# EAGLE design vl4e3 (EAGLE 6.0)

## Sheet 1 of 7
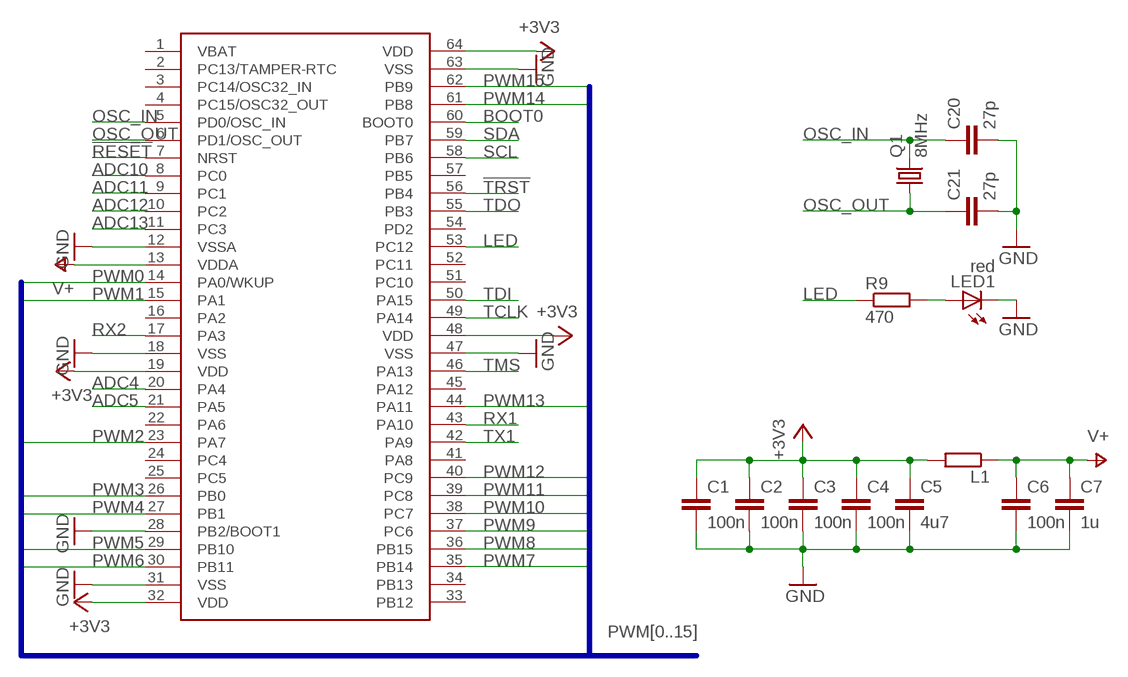
[diagram p0: schematic, sheet 1]

### Parts
C1  100n  C-EUC0603  [C0603]
C2  100n  C-EUC0603  [C0603]
C3  100n  C-EUC0603  [C0603]
C4  100n  C-EUC0603  [C0603]
C5  4u7  C-EUC0805  [C0805]
C6  100n  C-EUC0603  [C0603]
C7  1u  C-EUC0805  [C0805]
C20  27p  C-EUC0603  [C0603]
C21  27p  C-EUC0603  [C0603]
L1  R-EU_R0805  [R0805]
LED1  red  LEDCHIPLED_0805  [CHIPLED_0805]
Q1  8MHz  CRYSTALHC49S  [HC49/S]
R9  470  R-EU_R0805  [R0805]
U$1  STM32F100R  [TQFP64-10X10]

### Nets
!RESET: U$1.7(NRST) ; also sheet 3
!TRST: U$1.56(PB4) ; also sheet 3
+3V3: C1.1 C2.1 C3.1 C4.1 C5.1 L1.2 U$1.19(VDD) U$1.32(VDD) U$1.48(VDD) U$1.64(VDD) ; also sheet 2,4,5
ADC4: U$1.20(PA4) ; also sheet 5
ADC5: U$1.21(PA5) ; also sheet 5
ADC10: U$1.8(PC0) ; also sheet 5
ADC11: U$1.9(PC1) ; also sheet 5
ADC12: U$1.10(PC2) ; also sheet 5
ADC13: U$1.11(PC3) ; also sheet 5
BOOT0: U$1.60(BOOT0) ; also sheet 3
GND: C1.2 C2.2 C3.2 C4.2 C5.2 C6.2 C7.2 C20.2 C21.2 LED1.C U$1.12(VSSA) U$1.18(VSS) U$1.28(PB2/BOOT1) U$1.31(VSS) U$1.47(VSS) U$1.63(VSS) ; also sheet 2,3,4,5,6,7
LED: R9.1 U$1.53(PC12)
LED_R: LED1.A R9.2
OSC_IN: C20.1 Q1.2 U$1.5(PD0/OSC_IN)
OSC_OUT: C21.1 Q1.1 U$1.6(PD1/OSC_OUT)
PWM0: U$1.14(PA0/WKUP) ; also sheet 6
PWM1: U$1.15(PA1) ; also sheet 6
PWM2: U$1.23(PA7) ; also sheet 6
PWM3: U$1.26(PB0) ; also sheet 6
PWM4: U$1.27(PB1) ; also sheet 6
PWM5: U$1.29(PB10) ; also sheet 6
PWM6: U$1.30(PB11) ; also sheet 6
PWM7: U$1.35(PB14) ; also sheet 6
PWM8: U$1.36(PB15) ; also sheet 6
PWM9: U$1.37(PC6) ; also sheet 6
PWM10: U$1.38(PC7) ; also sheet 6
PWM11: U$1.39(PC8) ; also sheet 6
PWM12: U$1.40(PC9) ; also sheet 6
PWM13: U$1.44(PA11) ; also sheet 6
PWM14: U$1.61(PB8) ; also sheet 6
PWM15: U$1.62(PB9) ; also sheet 6
RX1: U$1.43(PA10) ; also sheet 3
RX2: U$1.17(PA3) ; also sheet 4
SCL: U$1.58(PB6)
SDA: U$1.59(PB7)
TCLK: U$1.49(PA14) ; also sheet 3
TDI: U$1.50(PA15) ; also sheet 3
TDO: U$1.55(PB3) ; also sheet 3
TMS: U$1.46(PA13) ; also sheet 3
TX1: U$1.42(PA9) ; also sheet 3
V+: C6.1 C7.1 L1.1 U$1.13(VDDA)
Unconnected: U$1.1(VBAT) U$1.2(PC13/TAMPER-RTC) U$1.3(PC14/OSC32_IN) U$1.4(PC15/OSC32_OUT) U$1.16(PA2) U$1.22(PA6) U$1.24(PC4) U$1.25(PC5) U$1.33(PB12) U$1.34(PB13) U$1.41(PA8) U$1.45(PA12) U$1.51(PC10) U$1.52(PC11) U$1.54(PD2) U$1.57(PB5)

### Buses
PWM[0..15]

## Sheet 2 of 7
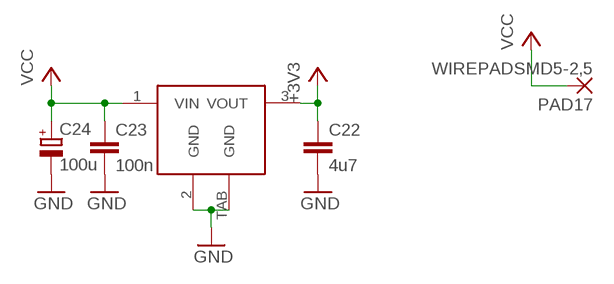
[diagram p1: schematic, sheet 2]

### Parts
C22  4u7  C-EUC0805  [C0805]
C23  100n  C-EUC0603  [C0603]
C24  100u  CPOL-EUE2.5-6  [E2,5-6]
PAD17  WIREPADSMD5-2,5  [5-2,5]
U$10  MIC5209  [SOT223]

### Nets
+3V3: C22.1 U$10.3(VOUT) ; also sheet 1,4,5
GND: C22.2 C23.2 C24.- U$10.2(GND) U$10.TAB(GND) ; also sheet 1,3,4,5,6,7
VCC: C23.1 C24.+ PAD17.1(P) U$10.1(VIN) ; also sheet 6

## Sheet 3 of 7
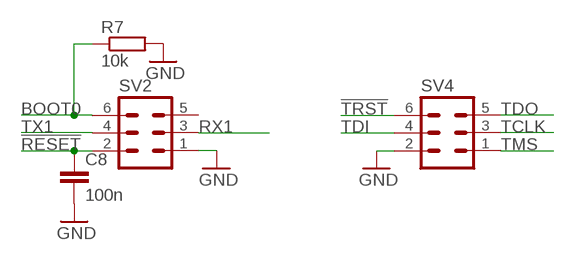
[diagram p2: schematic, sheet 3]

### Parts
C8  100n  C-EUC0603  [C0603]
R7  10k  R-EU_R0603  [R0603]
SV2  MA03-2  [MA03-2]
SV4  MA03-2  [MA03-2]

### Nets
!RESET: C8.1 SV2.2 ; also sheet 1
!TRST: SV4.6 ; also sheet 1
BOOT0: R7.1 SV2.6 ; also sheet 1
GND: C8.2 R7.2 SV2.1 SV4.2 ; also sheet 1,2,4,5,6,7
RX1: SV2.3 ; also sheet 1
TCLK: SV4.3 ; also sheet 1
TDI: SV4.4 ; also sheet 1
TDO: SV4.5 ; also sheet 1
TMS: SV4.1 ; also sheet 1
TX1: SV2.4 ; also sheet 1
Unconnected: SV2.5

## Sheet 4 of 7
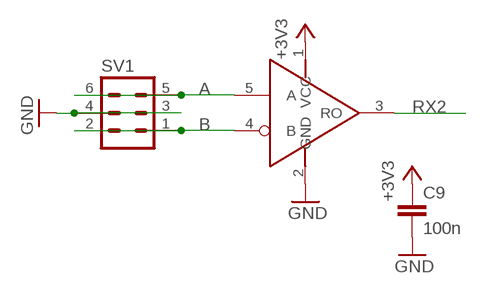
[diagram p3: schematic, sheet 4]

### Parts
C9  100n  C-EUC0603  [C0603]
SV1  MA03-2  [MA03-2]
U$13  ISL3280E  [SOT23-5L]

### Nets
+3V3: C9.1 U$13.1(VCC) ; also sheet 1,2,5
A: SV1.5 SV1.6 U$13.5(A)
B: SV1.1 SV1.2 U$13.4(B)
GND: C9.2 SV1.3 SV1.4 U$13.2(GND) ; also sheet 1,2,3,5,6,7
RX2: U$13.3(RO) ; also sheet 1

## Sheet 5 of 7
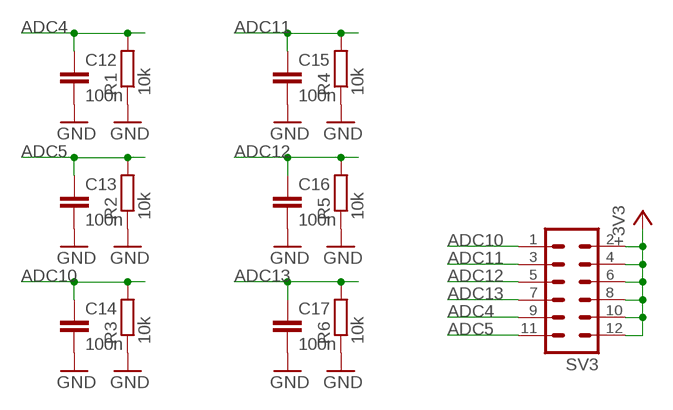
[diagram p4: schematic, sheet 5]

### Parts
C12  100n  C-EUC0603  [C0603]
C13  100n  C-EUC0603  [C0603]
C14  100n  C-EUC0603  [C0603]
C15  100n  C-EUC0603  [C0603]
C16  100n  C-EUC0603  [C0603]
C17  100n  C-EUC0603  [C0603]
R1  10k  R-EU_R0603  [R0603]
R2  10k  R-EU_R0603  [R0603]
R3  10k  R-EU_R0603  [R0603]
R4  10k  R-EU_R0603  [R0603]
R5  10k  R-EU_R0603  [R0603]
R6  10k  R-EU_R0603  [R0603]
SV3  MA06-2  [MA06-2]

### Nets
+3V3: SV3.2 SV3.4 SV3.6 SV3.8 SV3.10 SV3.12 ; also sheet 1,2,4
ADC4: C12.1 R1.2 SV3.9 ; also sheet 1
ADC5: C13.1 R2.2 SV3.11 ; also sheet 1
ADC10: C14.1 R3.2 SV3.1 ; also sheet 1
ADC11: C15.1 R4.2 SV3.3 ; also sheet 1
ADC12: C16.1 R5.2 SV3.5 ; also sheet 1
ADC13: C17.1 R6.2 SV3.7 ; also sheet 1
GND: C12.2 C13.2 C14.2 C15.2 C16.2 C17.2 R1.1 R2.1 R3.1 R4.1 R5.1 R6.1 ; also sheet 1,2,3,4,6,7

## Sheet 6 of 7
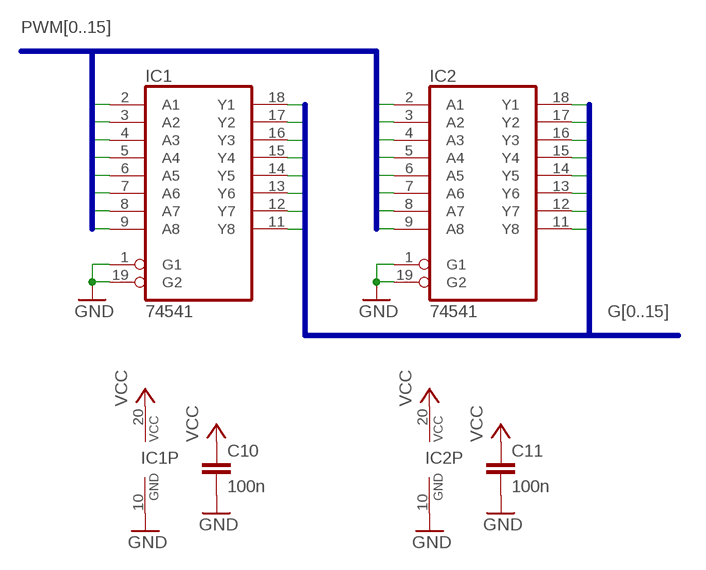
[diagram p5: schematic, sheet 6]

### Parts
C10  100n  C-EUC0603  [C0603]
C11  100n  C-EUC0603  [C0603]
IC1  74541  [TSSOP20]
IC2  74541  [TSSOP20]

### Nets
G0: IC1.18(Y1) ; also sheet 7
G1: IC1.17(Y2) ; also sheet 7
G2: IC1.16(Y3) ; also sheet 7
G3: IC1.15(Y4) ; also sheet 7
G4: IC1.14(Y5) ; also sheet 7
G5: IC1.13(Y6) ; also sheet 7
G6: IC1.12(Y7) ; also sheet 7
G7: IC1.11(Y8) ; also sheet 7
G8: IC2.18(Y1) ; also sheet 7
G9: IC2.17(Y2) ; also sheet 7
G10: IC2.16(Y3) ; also sheet 7
G11: IC2.15(Y4) ; also sheet 7
G12: IC2.14(Y5) ; also sheet 7
G13: IC2.13(Y6) ; also sheet 7
G14: IC2.12(Y7) ; also sheet 7
G15: IC2.11(Y8) ; also sheet 7
GND: C10.2 C11.2 IC1.1(G1) IC1.10(GND) IC1.19(G2) IC2.1(G1) IC2.10(GND) IC2.19(G2) ; also sheet 1,2,3,4,5,7
PWM0: IC1.2(A1) ; also sheet 1
PWM1: IC1.3(A2) ; also sheet 1
PWM2: IC1.4(A3) ; also sheet 1
PWM3: IC1.5(A4) ; also sheet 1
PWM4: IC1.6(A5) ; also sheet 1
PWM5: IC1.7(A6) ; also sheet 1
PWM6: IC1.8(A7) ; also sheet 1
PWM7: IC1.9(A8) ; also sheet 1
PWM8: IC2.2(A1) ; also sheet 1
PWM9: IC2.3(A2) ; also sheet 1
PWM10: IC2.4(A3) ; also sheet 1
PWM11: IC2.5(A4) ; also sheet 1
PWM12: IC2.6(A5) ; also sheet 1
PWM13: IC2.7(A6) ; also sheet 1
PWM14: IC2.8(A7) ; also sheet 1
PWM15: IC2.9(A8) ; also sheet 1
VCC: C10.1 C11.1 IC1.20(VCC) IC2.20(VCC) ; also sheet 2

### Buses
PWM[0..15]
G[0..15]

## Sheet 7 of 7
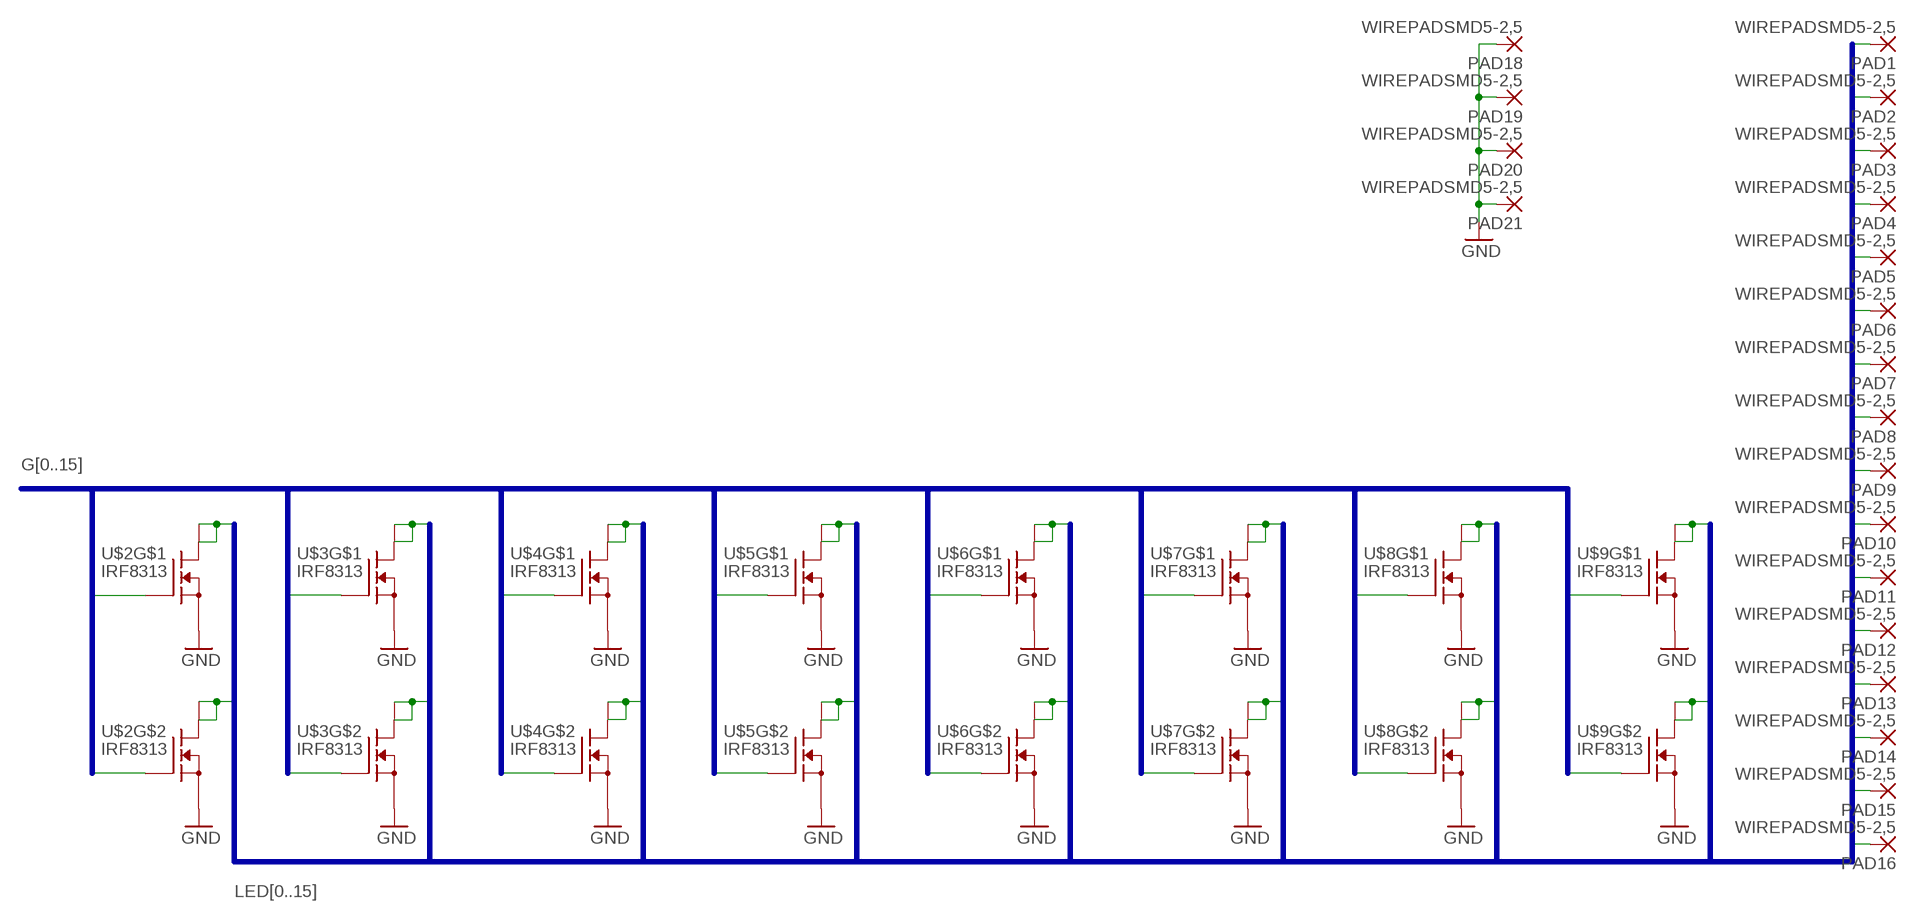
[diagram p6: schematic, sheet 7]

### Parts
PAD1  WIREPADSMD5-2,5  [5-2,5]
PAD2  WIREPADSMD5-2,5  [5-2,5]
PAD3  WIREPADSMD5-2,5  [5-2,5]
PAD4  WIREPADSMD5-2,5  [5-2,5]
PAD5  WIREPADSMD5-2,5  [5-2,5]
PAD6  WIREPADSMD5-2,5  [5-2,5]
PAD7  WIREPADSMD5-2,5  [5-2,5]
PAD8  WIREPADSMD5-2,5  [5-2,5]
PAD9  WIREPADSMD5-2,5  [5-2,5]
PAD10  WIREPADSMD5-2,5  [5-2,5]
PAD11  WIREPADSMD5-2,5  [5-2,5]
PAD12  WIREPADSMD5-2,5  [5-2,5]
PAD13  WIREPADSMD5-2,5  [5-2,5]
PAD14  WIREPADSMD5-2,5  [5-2,5]
PAD15  WIREPADSMD5-2,5  [5-2,5]
PAD16  WIREPADSMD5-2,5  [5-2,5]
PAD18  WIREPADSMD5-2,5  [5-2,5]
PAD19  WIREPADSMD5-2,5  [5-2,5]
PAD20  WIREPADSMD5-2,5  [5-2,5]
PAD21  WIREPADSMD5-2,5  [5-2,5]
U$2  IRF8313  [SO-08]
U$3  IRF8313  [SO-08]
U$4  IRF8313  [SO-08]
U$5  IRF8313  [SO-08]
U$6  IRF8313  [SO-08]
U$7  IRF8313  [SO-08]
U$8  IRF8313  [SO-08]
U$9  IRF8313  [SO-08]

### Nets
G0: U$2.2(G) ; also sheet 6
G1: U$2.4(G) ; also sheet 6
G2: U$3.2(G) ; also sheet 6
G3: U$3.4(G) ; also sheet 6
G4: U$4.2(G) ; also sheet 6
G5: U$4.4(G) ; also sheet 6
G6: U$5.2(G) ; also sheet 6
G7: U$5.4(G) ; also sheet 6
G8: U$6.2(G) ; also sheet 6
G9: U$6.4(G) ; also sheet 6
G10: U$7.2(G) ; also sheet 6
G11: U$7.4(G) ; also sheet 6
G12: U$8.2(G) ; also sheet 6
G13: U$8.4(G) ; also sheet 6
G14: U$9.2(G) ; also sheet 6
G15: U$9.4(G) ; also sheet 6
GND: PAD18.1(P) PAD19.1(P) PAD20.1(P) PAD21.1(P) U$2.1(S) U$2.3(S) U$3.1(S) U$3.3(S) U$4.1(S) U$4.3(S) U$5.1(S) U$5.3(S) U$6.1(S) U$6.3(S) U$7.1(S) U$7.3(S) U$8.1(S) U$8.3(S) U$9.1(S) U$9.3(S) ; also sheet 1,2,3,4,5,6
LED0: PAD1.1(P) U$2.7(D) U$2.8(D)
LED1: PAD2.1(P) U$2.5(D) U$2.6(D)
LED2: PAD3.1(P) U$3.7(D) U$3.8(D)
LED3: PAD4.1(P) U$3.5(D) U$3.6(D)
LED4: PAD5.1(P) U$4.7(D) U$4.8(D)
LED5: PAD6.1(P) U$4.5(D) U$4.6(D)
LED6: PAD7.1(P) U$5.7(D) U$5.8(D)
LED7: PAD8.1(P) U$5.5(D) U$5.6(D)
LED8: PAD9.1(P) U$6.7(D) U$6.8(D)
LED9: PAD10.1(P) U$6.5(D) U$6.6(D)
LED10: PAD11.1(P) U$7.7(D) U$7.8(D)
LED11: PAD12.1(P) U$7.5(D) U$7.6(D)
LED12: PAD13.1(P) U$8.7(D) U$8.8(D)
LED13: PAD14.1(P) U$8.5(D) U$8.6(D)
LED14: PAD15.1(P) U$9.7(D) U$9.8(D)
LED15: PAD16.1(P) U$9.5(D) U$9.6(D)

### Buses
G[0..15]
LED[0..15]

## Library data of the parts
C1-C17 C20-C23 = rcl:C-EU: CAPACITOR, European symbol
C24 = rcl:CPOL-EU: POLARIZED CAPACITOR, European symbol
IC1 IC2 = 74xx-eu_new:74*541: Octal BUFFER and LINE DRIVER, 3-state
L1 R1-R7 R9 = rcl:R-EU_: RESISTOR, European symbol
LED1 = led:LED: LED OSRAM: - CHIPLED LG R971, LG N971, LY N971, LG Q971, LY Q971, LO R971, LY R971 LH N974, LH R974 LS Q976, LO Q976, LY Q976 LO Q996 - Hyper CHIPLED LW Q18S LB Q993, LB Q99A, LB R99A - SideLED LS A670, LO A670, LY A670, LG A670, LP A670 LB A673, LV A673, LT A673, LW A673 LH A674 LY A675 LS A676, LA A676, LO A676, LY A676, LW A676 LS A679, LY A679, LG A679 - Hyper Micro SIDELED® LS Y876, LA Y876, LO Y876, LY Y876 LT Y87S - SmartLED LW L88C, LW L88S LB L89C, LB L89S, LG L890 LS L89K, LO L89K, LY L89K LS L896, LA L896, LO L896, LY L896 - TOPLED LS T670, LO T670, LY T670, LG T670, LP T670 LSG T670, LSP T670, LSY T670, LOP T670, LYG T670 LG T671, LOG T671, LSG T671 LB T673, LV T673, LT T673, LW T673 LH T674 LS T676, LA T676, LO T676, LY T676, LB T676, LH T676, LSB T676, LW T676 LB T67C, LV T67C, LT T67C, LS T67K, LO T67K, LY T67K, LW E67C LS E67B, LA E67B, LO E67B, LY E67B, LB E67C, LV E67C, LT E67C LW T67C LS T679, LY T679, LG T679 LS T770, LO T770, LY T770, LG T770, LP T770 LB T773, LV T773, LT T773, LW T773 LH T774 LS E675, LA E675, LY E675, LS T675 LS T776, LA T776, LO T776, LY T776, LB T776 LHGB T686 LT T68C, LB T68C - Hyper Mini TOPLED® LB M676 - Mini TOPLED Santana® LG M470 LS M47K, LO M47K, LY M47K Source: http://www.osram.convergy.de LUXEON: - LUMILED® LXK2-PW12-R00, LXK2-PW12-S00, LXK2-PW14-U00, LXK2-PW14-V00 LXK2-PM12-R00, LXK2-PM12-S00, LXK2-PM14-U00 LXK2-PE12-Q00, LXK2-PE12-R00, LXK2-PE12-S00, LXK2-PE14-T00, LXK2-PE14-U00 LXK2-PB12-K00, LXK2-PB12-L00, LXK2-PB12-M00, LXK2-PB14-N00, LXK2-PB14-P00, LXK2-PB14-Q00 LXK2-PR12-L00, LXK2-PR12-M00, LXK2-PR14-Q00, LXK2-PR14-R00 LXK2-PD12-Q00, LXK2-PD12-R00, LXK2-PD12-S00 LXK2-PH12-R00, LXK2-PH12-S00 LXK2-PL12-P00, LXK2-PL12-Q00, LXK2-PL12-R00 Source: www.luxeon.com KINGBRIGHT: KA-3528ASYC Source: www.kingbright.com
PAD1-PAD21 = wirepad:WIREPAD: Wire PAD connect wire on PCB
Q1 = crystal:CRYSTAL: CRYSTAL; OC_FARNELL: 1667008; OC_NEWARK: unknown
SV1 SV2 SV4 = con-lstb:MA03-2: PIN HEADER; OC_FARNELL: unknown; OC_NEWARK: unknown
SV3 = con-lstb:MA06-2: PIN HEADER; OC_FARNELL: unknown; OC_NEWARK: unknown
U$1 = stm32f100r:STM32F100R
U$2-U$9 = irf8313:IRF8313
U$10 = mic5209:MIC5209
U$13 = isl3280e:ISL3280E

## Board
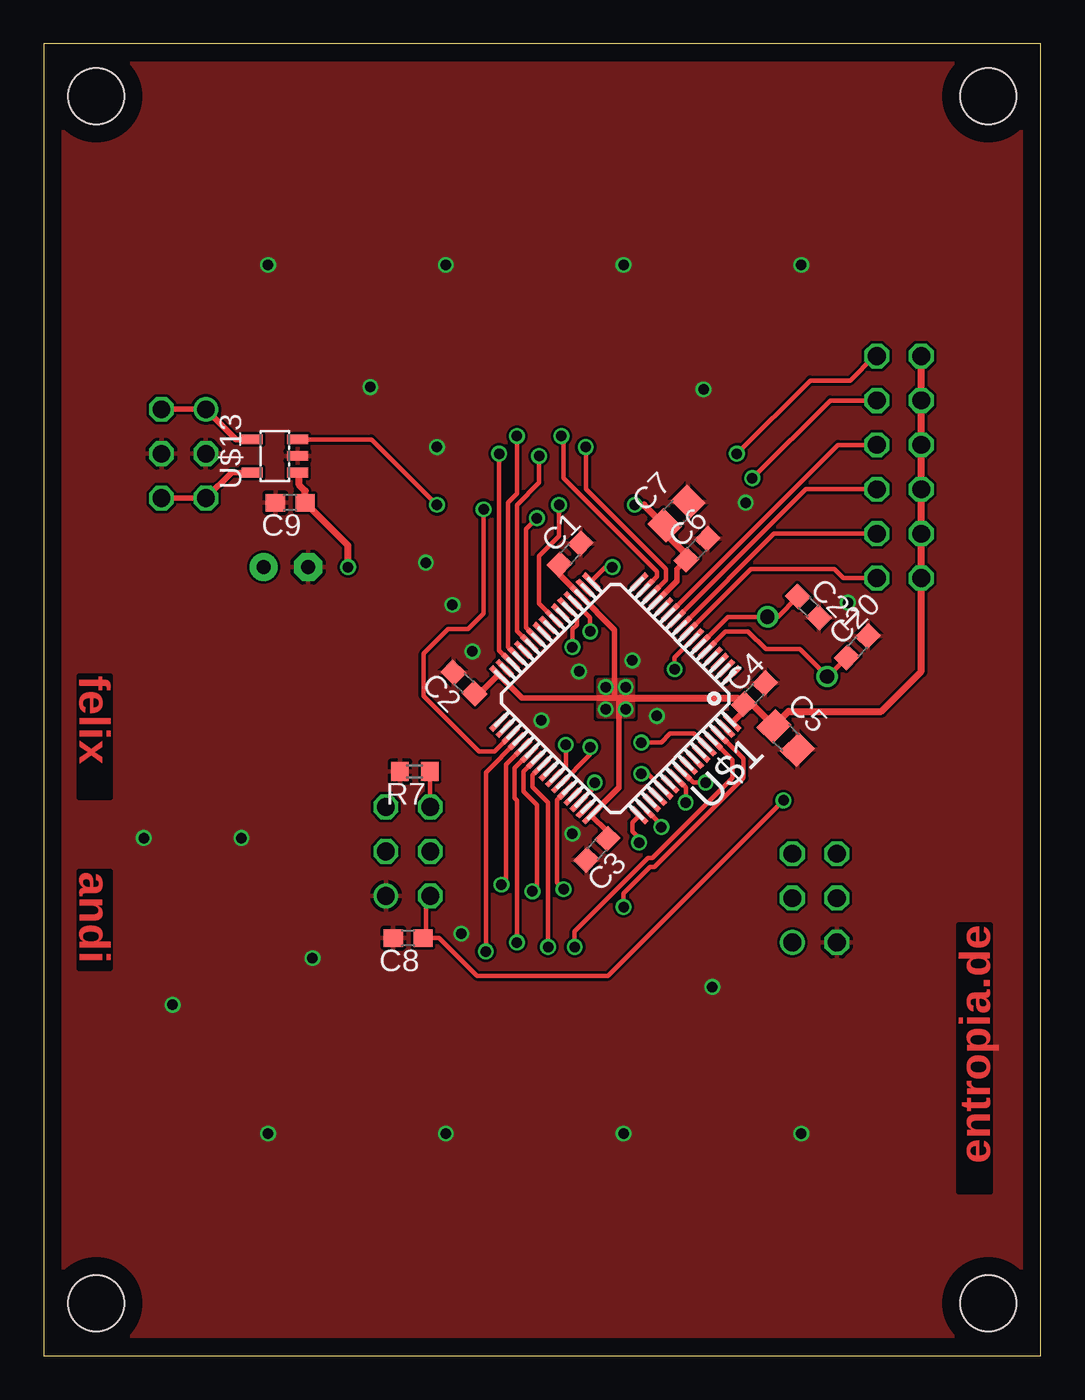
[diagram p7: board, top side]
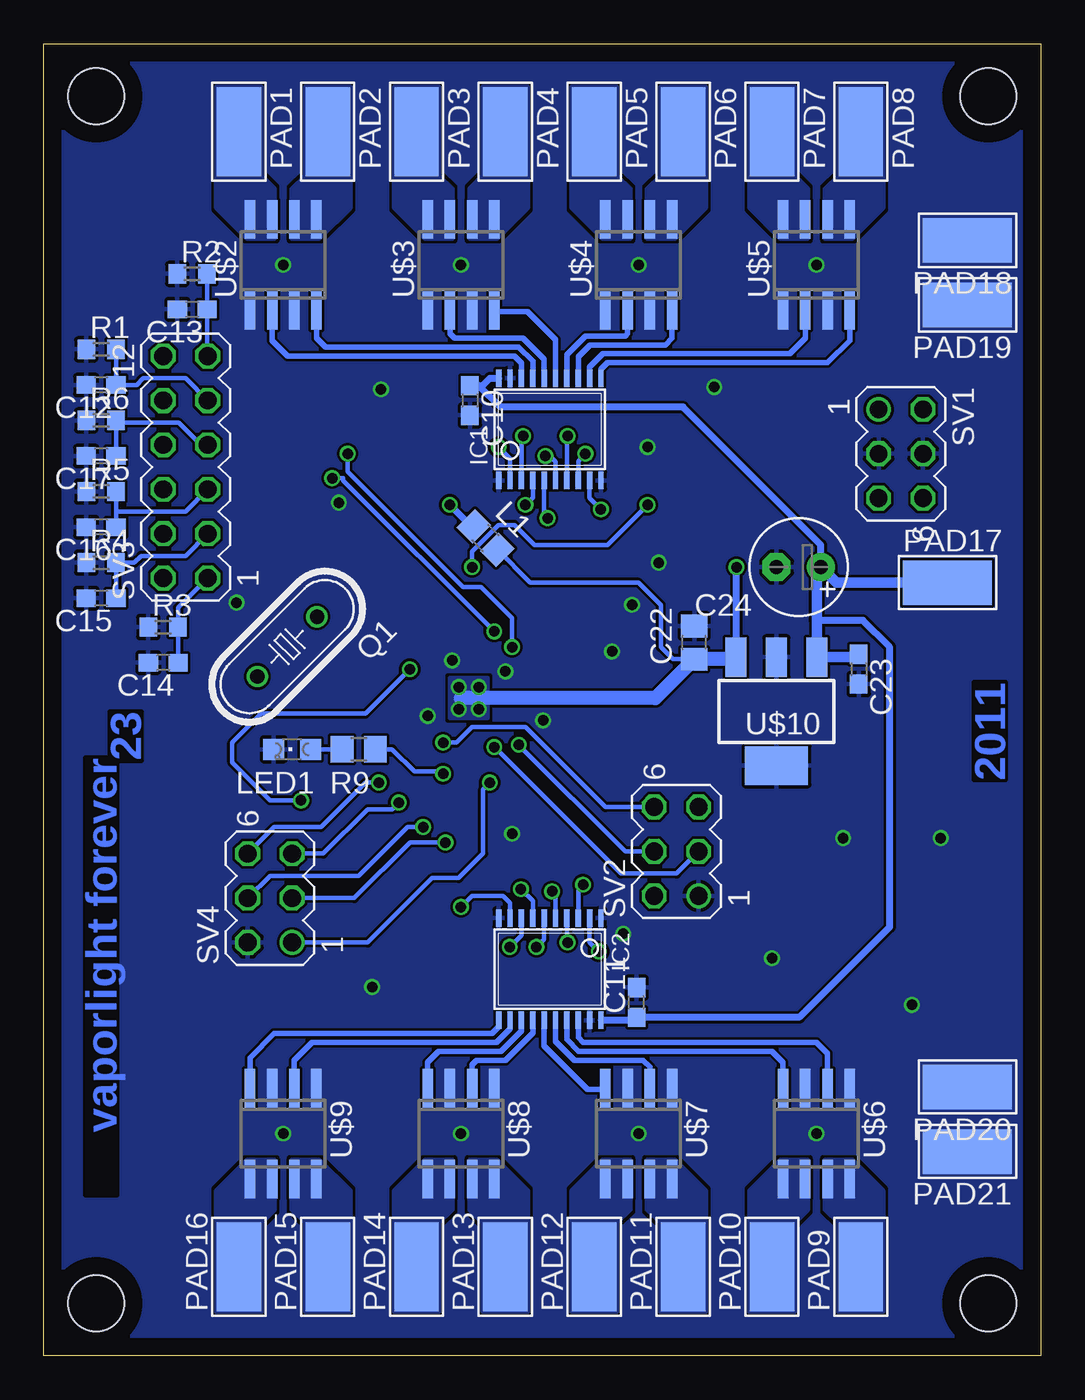
[diagram p8: board, bottom side, seen from below]

Size 57 x 75 mm. Coordinates in mm from the lower left corner, seen from the top.
Outline: 0,0 57,0 57,75 0,75 0,0
Copper layers (1*16): Top 0.035mm / dielectric 1.5mm / Bottom 0.035mm
Design rules: minimum track width 6mil, minimum drill 0.3mm, track to track 6mil, track to pad 6mil, pad to pad 6mil, via to via 6mil, smd to smd 6mil, copper to edge 40mil, drill to drill 8mil, minimum pad ring 8mil, minimum via ring 6mil, stop-mask expansion 3mil, vias tented up to drill 0mil, thermal gap 8mil
Holes 3.2 mm at 3,3 54,3 54,72 3,72

### Footprints (pad centres in the part's own frame; a part is rotated, then mirrored left to right if it is on the bottom)
C0603 = smd 1.1 x 1: 1 -0.85,0; 2 0.85,0
C0805 = smd 1.3 x 1.5: 1 -0.95,0; 2 0.95,0
E2,5-6 = drill 0.813 pad 1.6: + -1.27,0 | drill 0.813 pad 1.6 octagon: - 1.27,0
TSSOP20 = smd 0.305 x 0.991: 1 -2.925,-2.918; 2 -2.275,-2.918; 3 -1.625,-2.918; 4 -0.975,-2.918; 5 -0.325,-2.918; 6 0.325,-2.918; 7 0.975,-2.918; 8 1.625,-2.918; 9 2.275,-2.918; 10 2.925,-2.918; 11 2.925,2.918; 12 2.275,2.918; 13 1.625,2.918; 14 0.975,2.918; 15 0.325,2.918; 16 -0.325,2.918; 17 -0.975,2.918; 18 -1.625,2.918; 19 -2.275,2.918; 20 -2.925,2.918
R0805 = smd 1.3 x 1.5: 1 -0.95,0; 2 0.95,0
CHIPLED_0805 = smd 1.2 x 1.2: A 0,-1.05; C 0,1.05
5-2,5 = smd 2.54 x 5.08: 1 0,0
HC49/S = drill 0.813: 1 -2.413,0; 2 2.413,0
R0603 = smd 1 x 1.1: 1 -0.85,0; 2 0.85,0
MA03-2 = drill 1.016: 1 -2.54,-1.27 | drill 1.016 octagon: 2 -2.54,1.27; 3 0,-1.27; 4 0,1.27; 5 2.54,-1.27; 6 2.54,1.27
MA06-2 = drill 1.016 octagon: 1 -6.35,-1.27; 2 -6.35,1.27; 3 -3.81,-1.27; 4 -3.81,1.27; 5 -1.27,-1.27; 6 -1.27,1.27; 7 1.27,-1.27; 8 1.27,1.27; 9 3.81,-1.27; 10 3.81,1.27; 11 6.35,-1.27; 12 6.35,1.27
TQFP64-10X10 = smd 1.2 x 0.3: 1 -5.7,3.75; 2 -5.7,3.25; 3 -5.7,2.75; 4 -5.7,2.25; 5 -5.7,1.75; 6 -5.7,1.25; 7 -5.7,0.75; 8 -5.7,0.25; 9 -5.7,-0.25; 10 -5.7,-0.75; 11 -5.7,-1.25; 12 -5.7,-1.75; 13 -5.7,-2.25; 14 -5.7,-2.75; 15 -5.7,-3.25; 16 -5.7,-3.75; 33 5.7,-3.75; 34 5.7,-3.25; 35 5.7,-2.75; 36 5.7,-2.25; 37 5.7,-1.75; 38 5.7,-1.25; 39 5.7,-0.75; 40 5.7,-0.25; 41 5.7,0.25; 42 5.7,0.75; 43 5.7,1.25; 44 5.7,1.75; 45 5.7,2.25; 46 5.7,2.75; 47 5.7,3.25; 48 5.7,3.75 | smd 0.3 x 1.2: 17 -3.75,-5.7; 18 -3.25,-5.7; 19 -2.75,-5.7; 20 -2.25,-5.7; 21 -1.75,-5.7; 22 -1.25,-5.7; 23 -0.75,-5.7; 24 -0.25,-5.7; 25 0.25,-5.7; 26 0.75,-5.7; 27 1.25,-5.7; 28 1.75,-5.7; 29 2.25,-5.7; 30 2.75,-5.7; 31 3.25,-5.7; 32 3.75,-5.7; 49 3.75,5.7; 50 3.25,5.7; 51 2.75,5.7; 52 2.25,5.7; 53 1.75,5.7; 54 1.25,5.7; 55 0.75,5.7; 56 0.25,5.7; 57 -0.25,5.7; 58 -0.75,5.7; 59 -1.25,5.7; 60 -1.75,5.7; 61 -2.25,5.7; 62 -2.75,5.7; 63 -3.25,5.7; 64 -3.75,5.7
SO-08 = smd 0.6 x 2.2: 1 -1.905,-2.6; 2 -0.635,-2.6; 3 0.635,-2.6; 4 1.905,-2.6; 5 1.905,2.6; 6 0.635,2.6; 7 -0.635,2.6; 8 -1.905,2.6
SOT223 = smd 1.219 x 2.235: 1 -2.311,-3.099; 2 0,-3.099; 3 2.311,-3.099 | smd 3.6 x 2.2: TAB 0,3.099
SOT23-5L = smd 0.55 x 1.2: 1 -0.95,-1.3; 2 0,-1.3; 3 0.95,-1.3; 4 0.95,1.3; 5 -0.95,1.3

### Placement (x,y rotation side)
C1  30.09,45.84 45 top
C2  24.02,38.46 135 top
C3  31.62,28.96 225 top
C4  40.62,37.85 45 top
C5  42.42,35.32 315 top
C6  37.34,46.1 45 top
C7  36.17,48.14 45 top
C8  20.83,23.88 180 top
C9  14.1,48.77 180 top
C10  32.64,54.61 270 bottom
C11  23.11,20.19 90 bottom
C12  53.72,55.5 180 bottom
C13  48.51,59.82 180 bottom
C14  50.16,39.62 180 bottom
C15  53.72,43.31 180 bottom
C16  53.72,47.37 180 bottom
C17  53.72,51.44 180 bottom
C20  46.52,40.53 45 top
C21  43.72,42.8 315 top
C22  19.81,40.77 90 bottom
C23  10.41,39.24 270 bottom
C24  13.84,45.09 180 bottom
IC1  28.07,52.96 0 bottom
IC2  28.07,22.1 180 bottom
L1  31.74,46.75 315 bottom
LED1  42.8,34.67 90 bottom
PAD1  45.85,69.98 180 bottom
PAD2  40.77,69.98 180 bottom
PAD3  35.69,69.98 180 bottom
PAD4  30.61,69.98 180 bottom
PAD5  25.53,69.98 180 bottom
PAD6  20.45,69.98 180 bottom
PAD7  15.37,69.98 180 bottom
PAD8  10.29,69.98 180 bottom
PAD9  10.29,5.08 0 bottom
PAD10  15.37,5.08 0 bottom
PAD11  20.45,5.08 0 bottom
PAD12  25.53,5.08 0 bottom
PAD13  30.61,5.08 0 bottom
PAD14  35.69,5.08 0 bottom
PAD15  40.77,5.08 0 bottom
PAD16  45.85,5.08 0 bottom
PAD17  5.33,44.2 270 bottom
PAD18  4.19,63.75 90 bottom
PAD19  4.19,60.07 90 bottom
PAD20  4.19,15.37 90 bottom
PAD21  4.19,11.68 90 bottom
Q1  43.08,40.53 225 bottom
R1  53.72,57.53 0 bottom
R2  48.51,61.85 0 bottom
R3  50.16,41.66 0 bottom
R4  53.72,45.34 0 bottom
R5  53.72,49.4 0 bottom
R6  53.72,53.47 0 bottom
R7  21.21,33.4 180 top
R9  38.99,34.67 180 bottom
SV1  8,51.56 270 bottom
SV2  20.83,28.83 90 bottom
SV3  48.9,50.8 90 bottom
SV4  44.07,26.16 90 bottom
U$1  32.68,37.57 225 top
U$2  43.31,62.36 0 bottom
U$3  33.15,62.36 0 bottom
U$4  22.99,62.36 0 bottom
U$5  12.83,62.36 0 bottom
U$6  12.83,12.7 180 bottom
U$7  22.99,12.7 180 bottom
U$8  33.15,12.7 180 bottom
U$9  43.31,12.7 180 bottom
U$10  15.11,36.83 180 bottom
U$13  13.21,51.44 90 top

### Tracks (layer width: path | path; a pad name or v marks a point on that pad's centre or on a via)
!RESET  (via drill 0.6)
  Top 0.254: U$1.7 36.07,39.9 v36.07,39.24 | v42.29,31.75 32.26,21.72 24.77,21.72 22.61,23.88 C8.1 | C8.1 | SV2.2 21.84,26.04 21.84,24.04 C8.1
  Bottom 0.254: v36.07,39.24 38.61,36.7 44.58,36.7 46.23,35.05 46.23,33.91 44.07,31.75 v42.29,31.75
!TRST  (via drill 0.6)
  Top 0.254: U$1.56 37.13,32.77 v37.85,32.77
  Bottom 0.254: SV4.6 43.81,30.23 41.15,30.23 38.61,32.77 v37.85,32.77
+3V3  (via drill 0.6)
  Top 0.305: C2.1 24.9,37.86 U$1.32 27.35,37.59 32.64,37.59 | C3.1 32.22,29.96 U$1.48 32.89,32.49 32.89,37.59 32.64,37.59 | C1.1 29.49,44.65 U$1.19 32.64,41.5 32.64,37.59 | 40.02,36.86 U$1.64
  Top 0.406: U$13.1 14.61,50.39 14.61,49.78 14.95,49.44 C9.1 17.4,46.32 v17.4,45.09 | SV3.12 SV3.10 SV3.8 SV3.6 SV3.4 SV3.2 50.16,39.12 47.88,36.83 42.58,36.83 C5.1 40.5,37.24 C4.1 | 32.89,37.59 39.67,37.59 C4.1 | C4.1 40.02,36.86
  Bottom 0.254: L1.2 29.19,44.2 22.99,44.2 21.72,42.93 21.72,40.51 21.02,39.82 C22.1
  Bottom 0.406: v17.4,45.09 17.4,39.95 U$10.3
  Bottom 0.813: U$10.3 17.54,39.82 C22.1 22.04,37.59 33.15,37.59
  other vias: 32.13,38.23 33.27,38.23 33.27,36.96 32.13,36.96
  pour Top (rank 3, no thermals): 31.75,38.61 33.66,38.61 33.66,36.58 31.75,36.58
  pour Bottom (rank 3, no thermals): 33.78,38.73 31.62,38.73 31.62,36.45 33.78,36.45
A
  Top 0.305: U$13.5 10.73,50.48 SV1.5 SV1.6
ADC4  (via drill 0.6)
  Top 0.254: U$1.20 31.24,42.19 v31.24,41.4 | v40.51,50.16 44.96,54.61 SV3.9
  Bottom 0.254: R1.2 C12.1 51.69,55.5 51.31,55.88 48.9,55.88 SV3.9 | v40.51,50.16 39.88,50.16 39.88,50.04 v31.24,41.4
ADC5  (via drill 0.6)
  Top 0.254: U$1.21 30.48,42.24 30.48,41.78 30.23,41.53 v30.23,40.51 | v39.62,51.56 43.81,55.75 46.1,55.75 47.5,57.15 SV3.11
  Bottom 0.254: R2.2 C13.1 47.66,57.19 SV3.11 | v30.23,40.51 30.23,42.16 32,43.94 33.02,43.94 39.62,50.55 v39.62,51.56
ADC10
  Top 0.254: SV3.1 45.72,44.45 45.21,44.96 40.41,44.96 U$1.8
  Bottom 0.254: C14.1 R3.2 49.31,42.76 SV3.1
ADC11
  Top 0.254: U$1.9 41.74,46.99 SV3.3
  Bottom 0.254: SV3.3 48.9,45.72 51.44,45.72 51.82,45.34 R4.2 C15.1
ADC12
  Top 0.254: U$1.10 43.57,49.53 SV3.5
  Bottom 0.254: SV3.5 48.9,48.26 52.83,48.26 | 52.83,48.26 52.87,48.22 C16.1 | 52.83,48.26 52.87,48.3 R5.2
ADC13
  Top 0.254: U$1.11 45.41,52.07 SV3.7
  Bottom 0.254: SV3.7 48.01,52.07 49.28,53.34 52.74,53.34 R6.2 C17.1
B
  Top 0.305: U$13.4 10.99,52.38 SV1.1 SV1.2
BOOT0  (via drill 0.6)
  Top 0.254: v34.16,35.05 35.31,35.05 35.81,35.56 37.16,35.56 U$1.60 | R7.1 22.1,33.4 SV2.6
  Bottom 0.254: v34.16,35.05 33.4,35.05 32.51,35.94 29.46,35.94 24.89,31.37 SV2.6
G0
  Bottom 0.305: IC1.18 29.69,56.74 30.1,57.15 43.05,57.15 43.94,58.04 U$2.2
G1
  Bottom 0.305: IC1.17 29.04,56.85 29.84,57.66 40.89,57.66 41.4,58.17 U$2.4
G2
  Bottom 0.305: IC1.16 28.39,56.97 29.59,58.17 33.53,58.17 33.78,58.42 U$3.2
G3
  Bottom 0.305: IC1.15 27.74,58.09 29.34,59.69 31.18,59.69 U$3.4
G4
  Bottom 0.305: 23.75,59.82 23.75,59.76 U$4.2 23.62,58.42 23.75,58.29 26.04,58.29 27.09,57.24 IC1.14
G5
  Bottom 0.305: IC1.13 26.44,57.12 25.78,57.78 21.46,57.78 21.08,58.17 U$4.4
G6
  Bottom 0.305: IC1.12 25.79,56.5 25.02,57.28 14.35,57.28 13.46,58.17 U$5.2
G7
  Bottom 0.305: IC1.11 25.14,56.39 24.77,56.77 12.19,56.77 10.92,58.04 U$5.4
G8
  Bottom 0.305: IC2.18 26.44,18.19 26.16,17.91 12.83,17.91 12.19,17.27 U$6.2
G9
  Bottom 0.305: IC2.17 27.09,18.07 26.42,17.4 15.37,17.4 14.73,16.76 U$6.4
G10
  Bottom 0.305: IC2.16 27.74,17.96 26.67,16.89 22.73,16.89 22.35,16.51 U$7.2
G11
  Bottom 0.305: IC2.15 28.39,17.72 25.91,15.24 24.95,15.24 U$7.4
G12
  Bottom 0.305: IC2.14 29.04,18.46 30.61,16.89 32.26,16.89 32.51,16.64 U$8.2
G13
  Bottom 0.305: IC2.13 29.69,18.57 30.86,17.4 34.42,17.4 35.05,16.76 U$8.4
G14
  Bottom 0.305: IC2.12 30.34,18.68 31.11,17.91 41.66,17.91 42.67,16.89 U$9.2
G15
  Bottom 0.305: IC2.11 30.99,18.79 31.37,18.41 43.81,18.41 45.21,17.02 U$9.4
GND  (via drill 0.6)
  other vias: 30.61,39.12 30.23,29.84 28.45,36.32 35.05,36.58 33.66,39.75 24.51,40.26 23.37,42.93 40.13,48.77 21.84,45.34 23.88,24.13 33.15,62.36 22.99,62.36 12.83,62.36 43.31,62.36 43.31,12.7 33.15,12.7 22.99,12.7 12.83,12.7 11.3,29.59 5.71,29.59 7.37,20.07 15.37,22.73 22.48,51.94 18.67,55.37 37.72,55.24 38.23,21.08 45.97,43.05
  pour Top (rank 4): -1.27,76.6 58.29,76.6 58.29,-1.27 -1.27,-1.27
  pour Bottom (rank 4): -1.27,76.6 58.29,76.6 58.29,-1.27 -1.27,-1.27
  pour Bottom (rank 3, no thermals): 9.02,62.36 48.39,62.36 48.39,57.28 9.02,57.28
  pour Bottom (rank 3, no thermals): 9.02,12.7 47.12,12.7 47.12,17.78 9.02,17.78
  pour Bottom (rank 3, no thermals): 1.14,66.29 7.87,66.29 7.87,57.4 1.14,57.4
  pour Bottom (rank 3, no thermals): 1.02,17.14 7.37,17.14 7.37,9.65 1.02,9.65
LED  (via drill 0.6)
  Top 0.254: U$1.53 34.5,33.27 v34.16,33.27
  Bottom 0.254: R9.1 37.08,34.67 35.81,33.4 34.29,33.4 v34.16,33.27
LED0
  pour Bottom (rank 3, no thermals): 43.81,63.88 43.81,66.67 44.58,67.44 44.58,72.52 47.12,72.52 47.12,65.66 45.34,63.88
LED1
  pour Bottom (rank 3, no thermals): 42.8,63.88 41.27,63.88 39.5,65.66 39.5,72.52 42.04,72.52 42.04,67.44 42.8,66.67
LED2
  pour Bottom (rank 3, no thermals): 33.66,63.88 33.66,66.67 34.42,67.44 34.42,72.52 36.96,72.52 36.96,65.66 35.18,63.88
LED3
  pour Bottom (rank 3, no thermals): 32.64,63.88 31.11,63.88 29.34,65.66 29.34,72.52 31.88,72.52 31.88,67.44 32.64,66.67
LED4
  pour Bottom (rank 3, no thermals): 23.5,63.88 23.5,66.67 24.26,67.44 24.26,72.52 26.8,72.52 26.8,65.66 25.02,63.88
LED5
  pour Bottom (rank 3, no thermals): 22.48,63.88 20.95,63.88 19.18,65.66 19.18,72.52 21.72,72.52 21.72,67.44 22.48,66.67
LED6
  pour Bottom (rank 3, no thermals): 13.34,63.88 13.34,66.67 14.1,67.44 14.1,72.52 16.64,72.52 16.64,65.66 14.86,63.88
LED7
  pour Bottom (rank 3, no thermals): 12.32,63.88 10.79,63.88 9.02,65.66 9.02,72.52 11.56,72.52 11.56,67.44 12.32,66.67
LED8
  pour Bottom (rank 3, no thermals): 12.32,11.18 12.32,8.38 11.56,7.62 11.56,2.54 9.02,2.54 9.02,9.4 10.79,11.18
LED9
  pour Bottom (rank 3, no thermals): 13.34,11.18 14.86,11.18 16.64,9.4 16.64,2.54 14.1,2.54 14.1,7.62 13.34,8.38
LED10
  pour Bottom (rank 3, no thermals): 22.48,11.18 22.48,8.38 21.72,7.62 21.72,2.54 19.18,2.54 19.18,9.4 20.95,11.18
LED11
  pour Bottom (rank 3, no thermals): 23.5,11.18 25.02,11.18 26.8,9.4 26.8,2.54 24.26,2.54 24.26,7.62 23.5,8.38
LED12
  pour Bottom (rank 3, no thermals): 32.64,11.18 32.64,8.38 31.88,7.62 31.88,2.54 29.34,2.54 29.34,9.4 31.11,11.18
LED13
  pour Bottom (rank 3, no thermals): 33.66,11.18 35.18,11.18 36.96,9.4 36.96,2.54 34.42,2.54 34.42,7.62 33.66,8.38
LED14
  pour Bottom (rank 3, no thermals): 42.8,11.18 42.8,8.38 42.04,7.62 42.04,2.54 39.5,2.54 39.5,9.4 41.27,11.18
LED15
  pour Bottom (rank 3, no thermals): 43.81,11.18 45.34,11.18 47.12,9.4 47.12,2.54 44.58,2.54 44.58,7.62 43.81,8.38
LED_R
  Bottom 0.254: R9.2 LED1.A
OSC_IN
  Top 0.254: U$1.5 38.98,41.4 40.26,41.4 41.27,40.39 43.23,40.39 Q1.2 44.82,38.83 C20.1
OSC_OUT
  Top 0.254: U$1.6 39.11,42.24 Q1.1 41.96,42.24 C21.1
PWM0  (via drill 0.6)
  Top 0.254: U$1.14 35.56,44.35 35.56,44.96 30.99,49.53 v30.99,51.94
  Bottom 0.254: v30.99,51.94 30.34,51.3 IC1.2
PWM1  (via drill 0.6)
  Top 0.254: U$1.15 35.05,44.55 35.05,44.83 29.72,50.16 29.72,52.45 v29.59,52.58
  Bottom 0.254: v29.59,52.58 29.69,52.48 IC1.3
PWM2  (via drill 0.6)
  Top 0.254: U$1.23 28.32,42.99 28.32,45.72 29.46,46.86 v29.46,48.64
  Bottom 0.254: v29.46,48.64 29.04,49.06 IC1.4
PWM3  (via drill 0.6)
  Top 0.254: U$1.26 27.56,41.63 27.56,47.24 v28.19,47.88
  Bottom 0.254: v28.19,47.88 28.39,48.08 IC1.5
PWM4  (via drill 0.6)
  Top 0.254: U$1.27 27.05,41.43 27.05,48.64 28.32,49.91 v28.32,51.44
  Bottom 0.254: v28.32,51.44 28.07,51.44 27.74,51.11 IC1.6
PWM5  (via drill 0.6)
  Top 0.254: U$1.29 26.54,40.52 26.54,48.77 27.05,49.28 v27.05,52.58
  Bottom 0.254: v27.05,52.58 27.09,52.54 IC1.7
PWM6  (via drill 0.6)
  Top 0.254: U$1.30 26.04,40.33 v26.04,51.56
  Bottom 0.254: v26.04,51.56 26.44,51.16 IC1.8
PWM7  (via drill 0.6)
  Top 0.254: U$1.35 25.76,34.54 24.89,34.54 21.72,37.72 21.72,40.13 23.11,41.53 24.26,41.53 25.15,42.42 v25.15,48.39
  Bottom 0.254: IC1.9 25.79,49.03 v25.15,48.39
PWM8  (via drill 0.6)
  Top 0.254: U$1.36 25.27,33.35 v25.27,23.11
  Bottom 0.254: v25.27,23.11 25.79,23.63 IC2.2
PWM9  (via drill 0.6)
  Top 0.254: U$1.37 26.42,33.79 26.42,27.18 v26.16,26.92
  Bottom 0.254: v26.16,26.92 26.44,26.64 IC2.3
PWM10  (via drill 0.6)
  Top 0.254: U$1.38 26.92,33.59 26.92,31.88 27.05,31.75 v27.05,23.62
  Bottom 0.254: v27.05,23.62 27.09,23.66 IC2.4
PWM11  (via drill 0.6)
  Top 0.254: U$1.39 27.43,33.39 27.43,32.26 28.19,31.5 28.19,26.8 v27.94,26.54
  Bottom 0.254: v27.94,26.54 27.74,26.34 IC2.5
PWM12  (via drill 0.6)
  Top 0.254: U$1.40 27.94,33.19 27.94,32.51 28.83,31.62 v28.83,23.37
  Bottom 0.254: v28.83,23.37 28.39,23.8 IC2.6
PWM13  (via drill 0.6)
  Top 0.254: U$1.44 29.34,31.76 29.34,27.05 v29.72,26.67
  Bottom 0.254: IC2.7 29.04,25.99 v29.72,26.67
PWM14  (via drill 0.6)
  Top 0.254: U$1.61 39.37,34.06 39.37,33.02 34.8,28.45 34.54,28.45 30.35,24.26 v30.35,23.37
  Bottom 0.254: v30.35,23.37 29.69,24.03 IC2.8
PWM15  (via drill 0.6)
  Top 0.254: U$1.62 40.01,34.13 40.01,33.02 34.92,27.94 34.67,27.94 33.15,26.42 v33.15,25.65
  Bottom 0.254: IC2.9 30.34,25.9 30.73,26.29 32.51,26.29 v33.15,25.65
RX1  (via drill 0.6)
  Top 0.254: U$1.43 31.24,34.37 v31.24,34.8
  Bottom 0.254: v31.24,34.8 24,27.56 20.83,27.56 SV2.3
RX2  (via drill 0.6)
  Top 0.254: U$1.17 32.13,45.09 v32.51,45.09 | U$13.3 18.73,52.38 v22.48,48.64
  Bottom 0.254: v22.48,48.64 24.77,46.35 28.96,46.35 30.1,47.5 30.99,47.5 32.51,45.97 v32.51,45.09
TCLK  (via drill 0.6)
  Top 0.254: U$1.49 33.66,30.49 33.66,29.97 34.04,29.59 v34.04,29.34
  Bottom 0.254: v34.04,29.34 36.07,29.34 39.24,26.16 SV4.3
TDI  (via drill 0.6)
  Top 0.254: U$1.50 35.31,30.35 v35.31,30.23
  Bottom 0.254: v35.31,30.23 36.2,30.23 38.99,27.43 44.07,27.43 SV4.4
TDO  (via drill 0.6)
  Top 0.254: U$1.55 36.7,32.49 v36.7,31.62
  Bottom 0.254: 36.96,31.37 v36.7,31.62 37.08,31.24 38.48,31.24 41.02,28.7 SV4.5
TMS  (via drill 0.6)
  Top 0.254: U$1.46 31.5,32.5 v31.5,32.77
  Bottom 0.254: SV4.1 38.48,23.62 34.8,27.3 33.27,27.3 31.88,28.7 31.88,32.38 v31.5,32.77
TX1  (via drill 0.6)
  Top 0.254: U$1.42 29.84,33.68 v29.84,34.92
  Bottom 0.254: v29.84,34.92 23.75,28.83 SV2.4
V+  (via drill 0.6)
  Top 0.305: U$1.13 36.2,44.27 36.2,44.96 C6.1
  Top 0.406: C6.1 36.83,45.59 36.83,45.72 35.69,46.86 35.69,47.28 C7.1 | C7.1 35.5,47.18 | v33.78,48.64 34.33,48.64 C7.1
  Bottom 0.406: v33.78,48.64 32.56,47.42 L1.1
VCC
  Bottom 0.406: IC2.20 23.28,19.18 C11.1 13.8,19.34 8.64,24.51 8.64,40.51 10.16,42.04 12.8,42.04 | 32.13,55.46 C10.1 | 32.13,55.46 31.92,55.46 31.5,55.88 IC1.20 | C24.+ 12.57,46.35 20.45,54.23 30.9,54.23 32.13,55.46
  Bottom 0.61: C23.1 10.58,39.93 U$10.1 12.8,42.04 12.8,44.86 C24.+ 11.68,44.2 PAD17.1

### Text on the board
Top: felix | andi | entropia.de
Bottom: 2011 | 23 | vaporlight forever